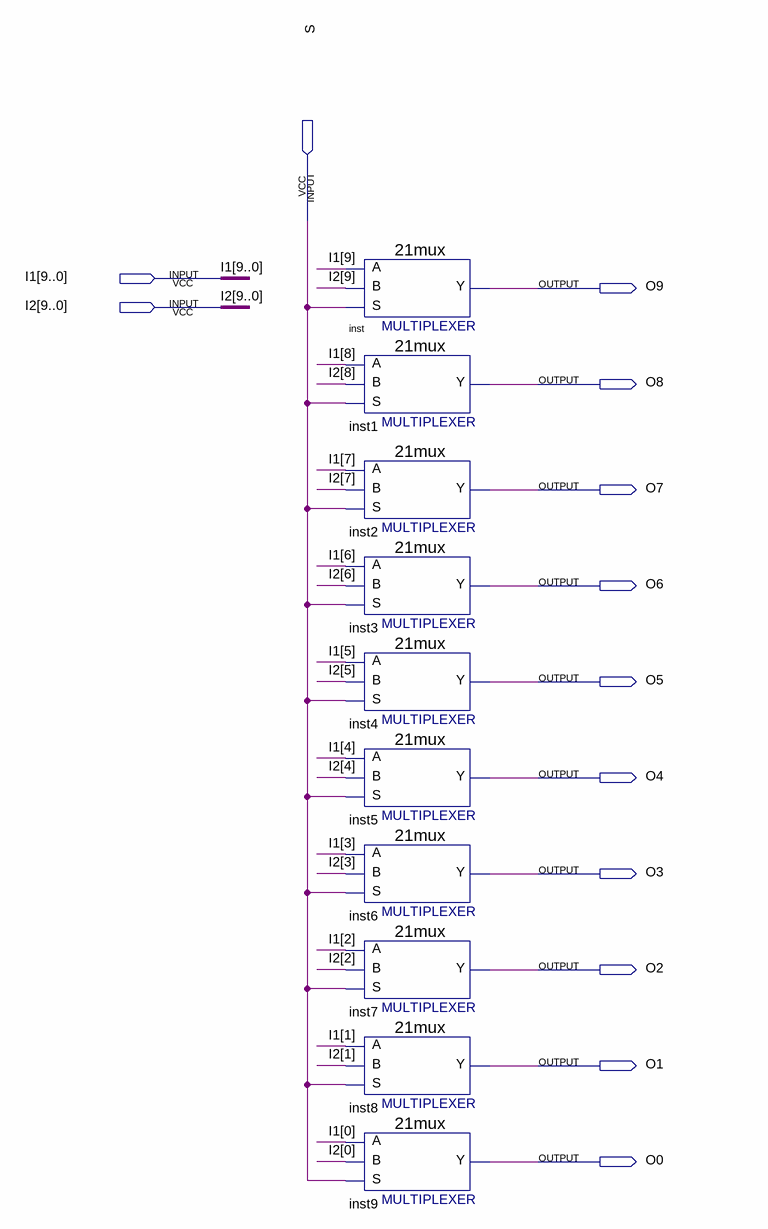
[diagram p0: schematic sheet]
// Quartus schematic mux2-1_10bit.bdf as structural Verilog: 10 symbols, 13 pins
module \mux2-1_10bit  (
  input  S,
  input  [9:0] I1,
  input  [9:0] I2,
  output O9,
  output O8,
  output O7,
  output O6,
  output O5,
  output O4,
  output O3,
  output O2,
  output O1,
  output O0
);

  \21mux  inst (.S(S), .B(I2[9]), .A(I1[9]), .Y(O9));
  \21mux  inst1 (.S(S), .B(I2[8]), .A(I1[8]), .Y(O8));
  \21mux  inst2 (.S(S), .B(I2[7]), .A(I1[7]), .Y(O7));
  \21mux  inst3 (.S(S), .B(I2[6]), .A(I1[6]), .Y(O6));
  \21mux  inst4 (.S(S), .B(I2[5]), .A(I1[5]), .Y(O5));
  \21mux  inst5 (.S(S), .B(I2[4]), .A(I1[4]), .Y(O4));
  \21mux  inst6 (.S(S), .B(I2[3]), .A(I1[3]), .Y(O3));
  \21mux  inst7 (.S(S), .B(I2[2]), .A(I1[2]), .Y(O2));
  \21mux  inst8 (.S(S), .B(I2[1]), .A(I1[1]), .Y(O1));
  \21mux  inst9 (.S(S), .B(I2[0]), .A(I1[0]), .Y(O0));
endmodule
